# EAGLE board LEDSyncDRVG2 (EAGLE 9.6.2), part 1 of 3
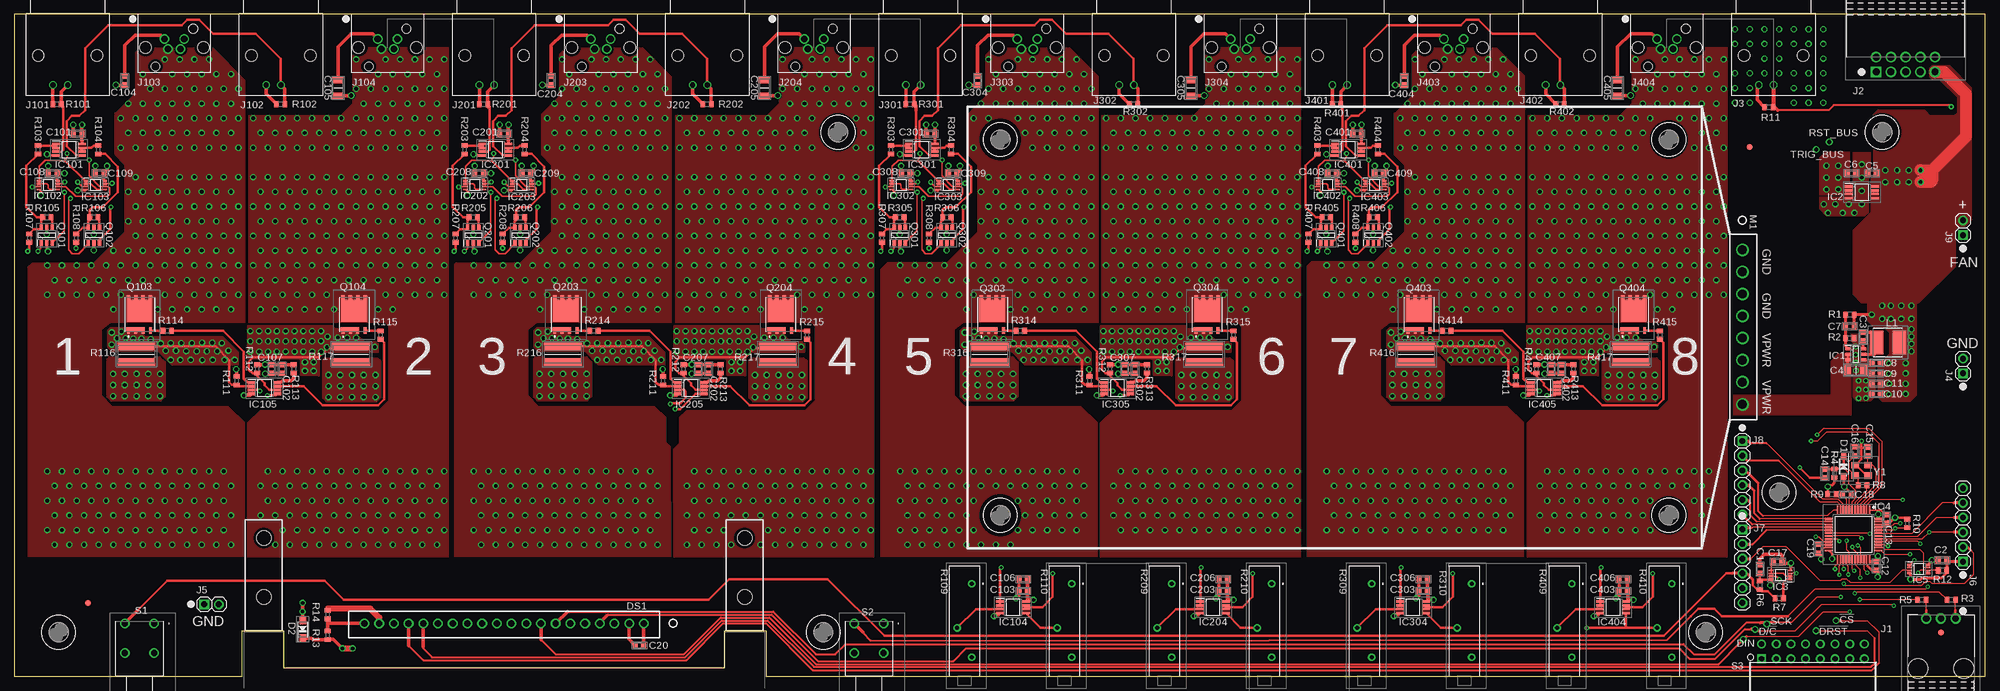
[diagram p5: board, top side]
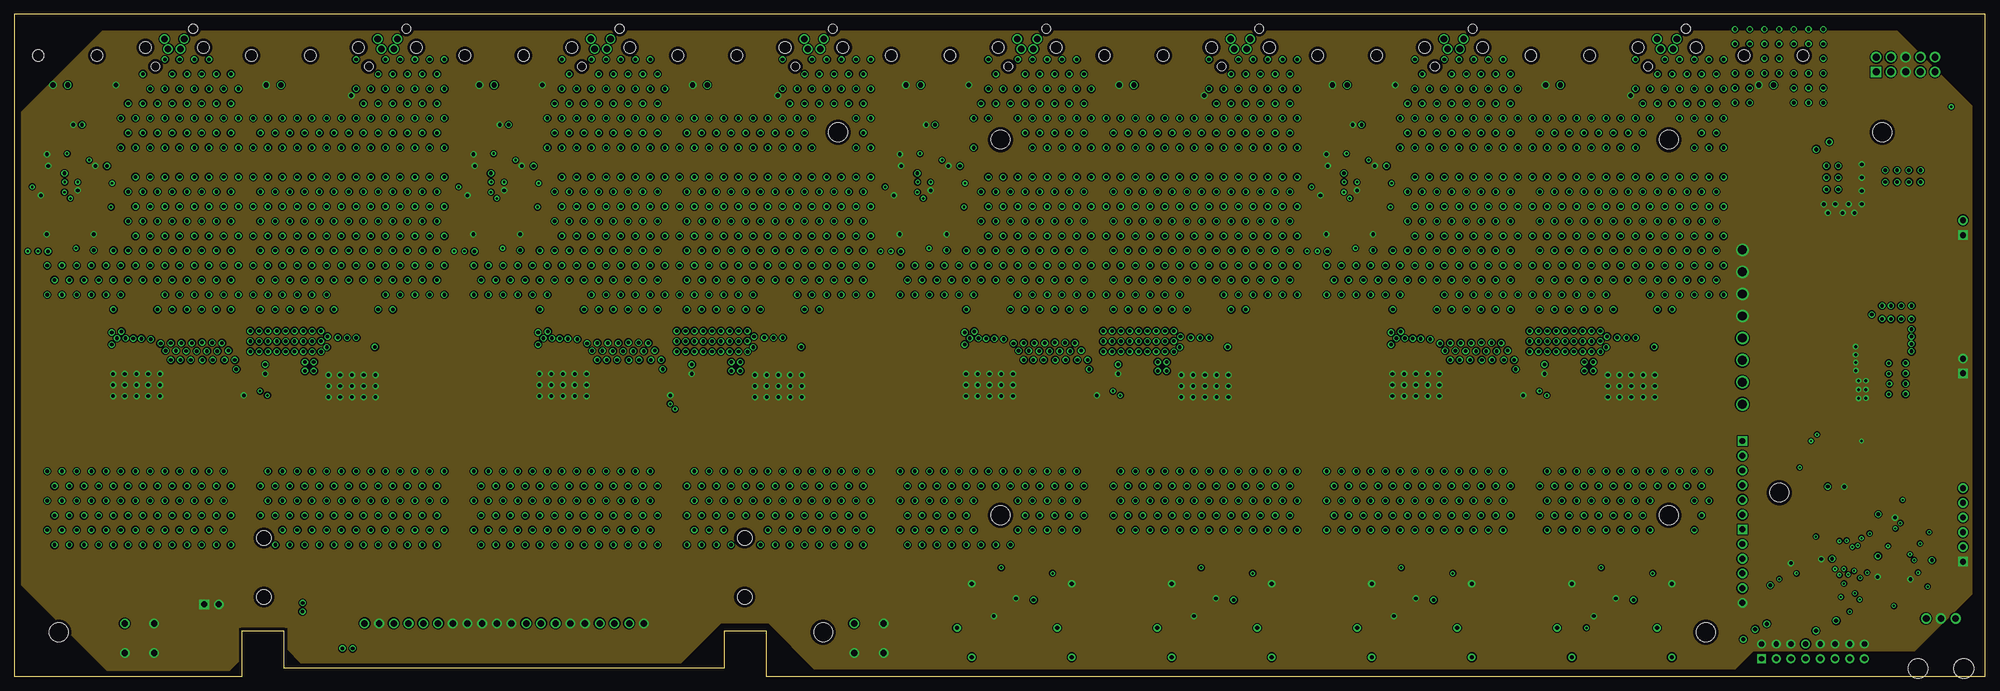
[diagram p6: board, inner layer Route2]
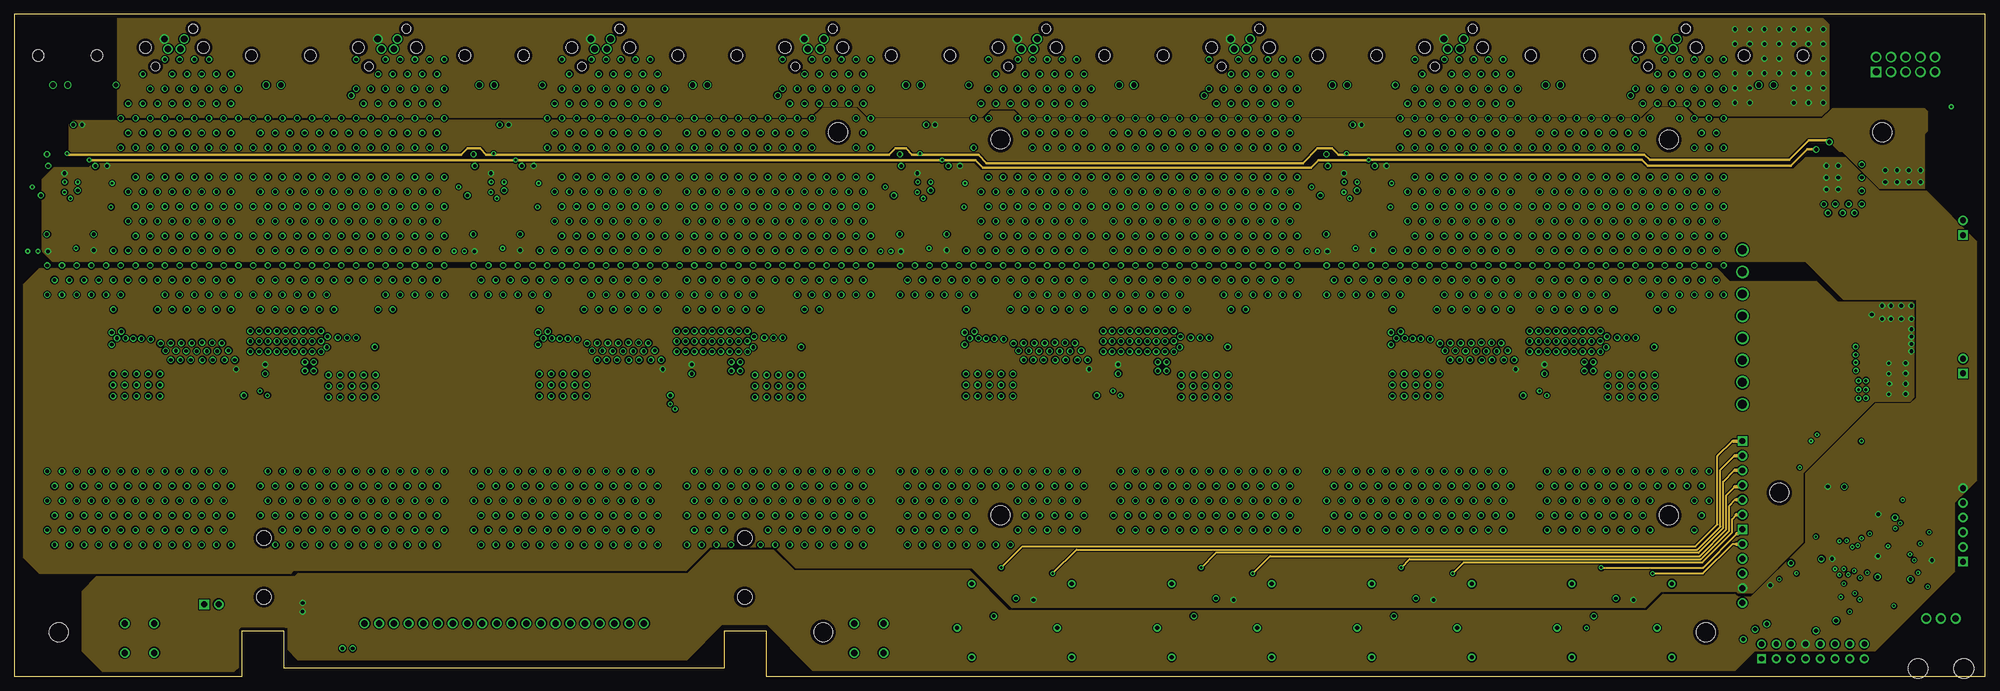
[diagram p7: board, inner layer Route15]
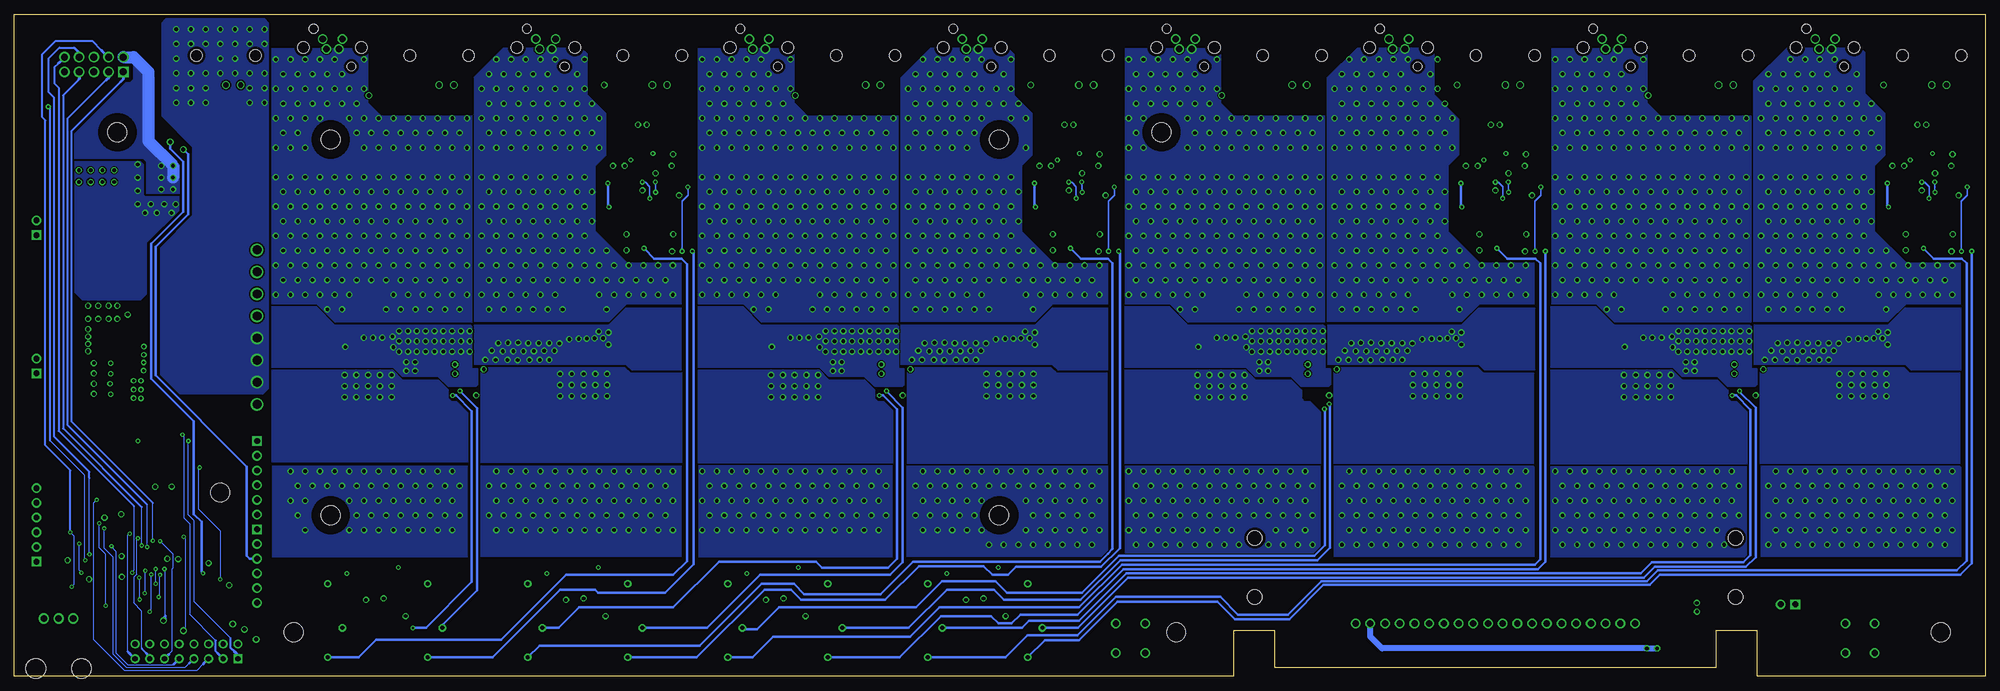
[diagram p8: board, bottom side, seen from below]

Size 340.36 x 114.3 mm. Coordinates in mm from the lower left corner, seen from the top.
Outline: 0,0 39.37,0 39.37,7.87 46.48,7.87 46.48,1.52 122.68,1.52 122.68,7.87 129.79,7.87 129.79,0 340.36,0 340.36,114.3 0,114.3 0,0
Copper layers (1+2*15+16): Top 0.035mm / dielectric 0.6mm / Route2 0.035mm / dielectric 0.25mm / Route15 0.035mm / dielectric 0.6mm / Bottom 0.035mm
Design rules "default *": minimum track width 8mil, minimum drill 0.3mm, track to track 8mil, track to pad 8mil, pad to pad 7.5mil, via to via 8mil, smd to smd 6mil, copper to edge 20mil, drill to drill 20mil, minimum pad ring 6mil, minimum via ring 8mil, stop-mask expansion 4mil, vias tented up to drill 26mil, thermal gap 10mil

## Footprints (pad centres in the part's own frame; a part is rotated, then mirrored left to right if it is on the bottom)
MLCC_0603 = smd 0.813 x 1.041: 1 -0.72,0; 2 0.72,0
MLCC_1206 = smd 1.07 x 1.78: 1 -1.36,0; 2 1.36,0
SOD3716X135N_DIODE = smd 1.15 x 0.8: 1 -1.75,0; 2 1.75,0
SOD-123FL = smd 1.24 x 1.12: 1 -1.5,0; 2 1.5,0
DISPLAY20P = drill 1.11 pad 1.665: 1 -24.13,0; 2 -21.59,0; 3 -19.05,0; 4 -16.51,0; 5 -13.97,0; 6 -11.43,0; 7 -8.89,0; 8 -6.35,0; 9 -3.81,0; 10 -1.27,0; 11 1.27,0; 12 3.81,0; 13 6.35,0; 14 8.89,0; 15 11.43,0; 16 13.97,0; 17 16.51,0; 18 19.05,0; 19 21.59,0; 20 24.13,0 | hole 2.54: -41.529,-14.732; -41.529,-4.572; 41.529,-14.732; 41.529,-4.572
4-40_130HOLE_260CLEAR = hole 3.302: 0,0
SOT95P280X100-6N = smd 1.05 x 0.55: 1 -1.3,0.95; 2 -1.3,0; 3 -1.3,-0.95; 4 1.3,-0.95; 5 1.3,0; 6 1.3,0.95
VSSOP8-DGK-065P = smd 1.4 x 0.45: 1 -2.2,0.975; 2 -2.2,0.325; 3 -2.2,-0.325; 4 -2.2,-0.975; 5 2.2,-0.975; 6 2.2,-0.325; 7 2.2,0.325; 8 2.2,0.975
SOP50P310X90-8N = smd 0.85 x 0.3: 1 -1.575,0.75; 2 -1.575,0.25; 3 -1.575,-0.25; 4 -1.575,-0.75; 5 1.575,-0.75; 6 1.575,-0.25; 7 1.575,0.25; 8 1.575,0.75
QFP50P900X900X160-48N = smd 1.475 x 0.3: 1 -4.238,2.75; 2 -4.238,2.25; 3 -4.238,1.75; 4 -4.238,1.25; 5 -4.238,0.75; 6 -4.238,0.25; 7 -4.238,-0.25; 8 -4.238,-0.75; 9 -4.238,-1.25; 10 -4.238,-1.75; 11 -4.238,-2.25; 12 -4.238,-2.75; 25 4.238,-2.75; 26 4.238,-2.25; 27 4.238,-1.75; 28 4.238,-1.25; 29 4.238,-0.75; 30 4.238,-0.25; 31 4.238,0.25; 32 4.238,0.75; 33 4.238,1.25; 34 4.238,1.75; 35 4.238,2.25; 36 4.238,2.75 | smd 0.3 x 1.475: 13 -2.75,-4.238; 14 -2.25,-4.238; 15 -1.75,-4.238; 16 -1.25,-4.238; 17 -0.75,-4.238; 18 -0.25,-4.238; 19 0.25,-4.238; 20 0.75,-4.238; 21 1.25,-4.238; 22 1.75,-4.238; 23 2.25,-4.238; 24 2.75,-4.238; 37 2.75,4.238; 38 2.25,4.238; 39 1.75,4.238; 40 1.25,4.238; 41 0.75,4.238; 42 0.25,4.238; 43 -0.25,4.238; 44 -0.75,4.238; 45 -1.25,4.238; 46 -1.75,4.238; 47 -2.25,4.238; 48 -2.75,4.238
HDR_1X3RAS = drill 1.17 pad 1.755: 1 0,0; 2 -2.54,0; 3 -5.08,0 | hole 3.45: -6.48,-8.64; 1.4,-8.64
HDR_2X5M_RAS = drill 1.2 pad 1.8 square: 1 0,0 | drill 1.2 pad 1.8: 2 0,2.54; 3 2.54,0; 4 2.54,2.54; 5 5.08,0; 6 5.08,2.54; 7 7.62,0; 8 7.62,2.54; 9 10.16,0; 10 10.16,2.54
BNC_AMP_227161 = drill 0.9 pad 1.27: 1 0,-5.08; 2 -2.54,-5.08 | hole 2: -5.08,0; 5.08,0
HDR_1X2 = drill 1.016 pad 1.651 square: 1 -2.54,0 | drill 1.016 pad 1.651: 2 0,0
HDR_1X06 = drill 1.016 pad 1.651 square: 1 -6.35,0 | drill 1.016 pad 1.651: 2 -3.81,0; 3 -1.27,0; 4 1.27,0; 5 3.81,0; 6 6.35,0
CIR_PHX4P_RA = drill 1.143 pad 1.626: 1 1.702,-1.499; 2 1.067,0.254; 3 -1.067,0.254; 4 -1.702,-1.499 | hole 1.524: -3.251,-3.251; 3.251,3.251 | hole 2.032: 5.004,0; -5.004,0
IND_5X5MM-5045 = smd 2.3 x 4: 1 -2,0; 2 2,0
PS_5X3_MOLEX8P = drill 1.524 pad 2.159: 1 12.7,-19.05; 2 12.7,-22.86; 3 12.7,-26.67; 4 12.7,-30.48; 5 12.7,-34.29; 6 12.7,-38.1; 7 12.7,-41.91; 8 12.7,-45.72 | hole 3.302: 0,0; -115.468,0; -115.468,-64.897; 0,-64.897
TDSON-8 = smd 0.5 x 0.5: 1 -1.905,-3.075; 2 -0.635,-3.075; 3 0.635,-3.075 | smd 0.5 x 1.1: 4 1.905,-2.775 | smd 0.6 x 0.8: 5 1.905,2.925; 6 0.635,2.925; 7 -0.635,2.925; 8 -1.905,2.925 | smd 4.41 x 3.75: 9 0,0.65 | smd 3.2 x 0.6: 10 -0.715,-2.525
R0603 = smd 0.813 x 1.041: 1 -0.72,0; 2 0.72,0
MTBOURNS_RA_LONG = drill 0.74 pad 1.269: 1 0,0; 2 7.62,-2.54; 3 12.7,0
R1225 = smd 1.35 x 6.5: 1 -1.35,0; 2 1.35,0
SITCH_PB_RA_800SP9B6M6RE = drill 1.09 pad 1.635: 1 0,0; 3 5.08,0; MH1 0,5.08; MH2 5.08,5.08
SWITCHX8_DIP_RA_0.1IN = drill 0.914 pad 1.524 square: 1 0,0 | drill 0.914 pad 1.524: 2 0,2.54; 3 2.54,0; 4 2.54,2.54; 5 5.08,0; 6 5.08,2.54; 7 7.62,0; 8 7.62,2.54; 9 10.16,0; 10 10.16,2.54; 11 12.7,0; 12 12.7,2.54; 13 15.24,0; 14 15.24,2.54; 15 17.78,0; 16 17.78,2.54
FIDUCIAL_1MM = smd 1 x 1: 1 0,0
XTAL4P_3.2X2.5MM = smd 1.3 x 1.1: 1 -1.15,-0.9; 2 1.15,-0.9; 3 1.15,0.9; 4 -1.15,0.9

## Placement (x,y rotation side)
C1  0.10uF  [MLCC_0603]  301.5,18.54 270 top
C2  0.10uF  [MLCC_0603]  332.99,20.07 180 top
C3  0.10uF  [MLCC_0603]  319.28,58.67 90 top
C4  10uF  [MLCC_1206]  318.01,52.83 0 top
C5  1uF  [MLCC_0603]  320.85,86.89 180 top
C6  1uF  [MLCC_0603]  317.3,86.89 0 top
C7  47pF  [MLCC_0603]  316.99,60.45 0 top
C8  10uF  [MLCC_0603]  321.56,54.1 0 top
C9  10uF  [MLCC_0603]  321.56,52.32 0 top
C10  10uF  [MLCC_0603]  321.56,48.77 0 top
C11  10uF  [MLCC_0603]  321.56,50.55 0 top
C12  0.10uF  [MLCC_0603]  321.56,19.05 90 top
C13  0.10uF  [MLCC_0603]  323.34,27.18 90 top
C14  0.10uF  [MLCC_0603]  312.67,35.05 270 top
C15  10pF  [MLCC_0603]  320.14,38.86 270 top
C16  10pF  [MLCC_0603]  317.88,38.89 270 top
C17  1uF  [MLCC_0603]  304.55,19.81 0 top
C18  0.10uF  [MLCC_0603]  316.48,31.39 180 top
C19  10uF  [MLCC_0603]  311.56,22.05 90 top
C20  0.10uF  [MLCC_0603]  107.95,5.33 0 top
C101  0.10uF  [MLCC_0603]  10.92,93.73 0 top
C102  0.10uF  [MLCC_0603]  46.23,53.09 90 top
C103  0.10uF  [MLCC_0603]  174.24,14.73 0 top
C104  0.10uF  [MLCC_0603]  19.05,102.87 90 top
C105  10uF  [MLCC_1206]  55.88,101.6 270 top
C106  10uF  [MLCC_0603]  174.24,16.76 0 top
C107  10uF  [MLCC_0603]  44.45,53.09 90 top
C108  0.10uF  [MLCC_0603]  6.6,86.87 0 top
C109  0.10uF  [MLCC_0603]  14.73,86.87 0 top
C201  0.10uF  [MLCC_0603]  84.58,93.73 0 top
C202  0.10uF  [MLCC_0603]  119.89,53.09 90 top
C203  0.10uF  [MLCC_0603]  208.79,14.73 0 top
C204  0.10uF  [MLCC_0603]  92.71,102.87 90 top
C205  10uF  [MLCC_1206]  129.54,101.6 270 top
C206  10uF  [MLCC_0603]  208.79,16.76 0 top
C207  10uF  [MLCC_0603]  118.11,53.09 90 top
C208  0.10uF  [MLCC_0603]  80.26,86.87 0 top
C209  0.10uF  [MLCC_0603]  88.39,86.87 0 top
C301  0.10uF  [MLCC_0603]  158.24,93.73 0 top
C302  0.10uF  [MLCC_0603]  193.55,53.09 90 top
C303  0.10uF  [MLCC_0603]  243.33,14.73 0 top
C304  0.10uF  [MLCC_0603]  166.37,102.87 90 top
C305  10uF  [MLCC_1206]  203.2,101.6 270 top
C306  10uF  [MLCC_0603]  243.33,16.76 0 top
C307  10uF  [MLCC_0603]  191.77,53.09 90 top
C308  0.10uF  [MLCC_0603]  153.92,86.87 0 top
C309  0.10uF  [MLCC_0603]  162.05,86.87 0 top
C401  0.10uF  [MLCC_0603]  231.9,93.73 0 top
C402  0.10uF  [MLCC_0603]  267.21,53.09 90 top
C403  0.10uF  [MLCC_0603]  277.88,14.73 0 top
C404  0.10uF  [MLCC_0603]  240.03,102.87 90 top
C405  10uF  [MLCC_1206]  276.86,101.6 270 top
C406  10uF  [MLCC_0603]  277.88,16.76 0 top
C407  10uF  [MLCC_0603]  265.43,53.09 90 top
C408  0.10uF  [MLCC_0603]  227.58,86.87 0 top
C409  0.10uF  [MLCC_0603]  235.71,86.87 0 top
D1  3.6V  [SOD3716X135N_DIODE]  315.98,36.25 270 top
D2  NHP140  [SOD-123FL]  49.78,8.13 90 top
DS1  OLED Display Yellow 256X64  [DISPLAY20P]  84.58,9.14 180 top
H1  M-HOLE130MIL  [4-40_130HOLE_260CLEAR]  292.1,7.62 0 top
H2  M-HOLE130MIL  [4-40_130HOLE_260CLEAR]  304.8,31.75 0 top
H3  M-HOLE130MIL  [4-40_130HOLE_260CLEAR]  142.24,93.98 0 top
H4  M-HOLE130MIL  [4-40_130HOLE_260CLEAR]  322.58,93.98 0 top
H5  M-HOLE130MIL  [4-40_130HOLE_260CLEAR]  139.7,7.62 0 top
H6  M-HOLE130MIL  [4-40_130HOLE_260CLEAR]  7.62,7.62 0 top
IC1  AP63200  [SOT95P280X100-6N]  318.01,55.63 0 top
IC2  TLV76733  [VSSOP8-DGK-065P]  319.07,83.59 0 top
IC3  TC7WZ08  [SOP50P310X90-8N]  305.05,17.53 180 top
IC4  STM32F410  [QFP50P900X900X160-48N]  317.65,24.49 270 top
IC5  TC7WZ08  [SOP50P310X90-8N]  328.93,18.54 0 top
IC101  TLV2197  [VSSOP8-DGK-065P]  9.4,90.93 0 top
IC102  TC7WZ08  [SOP50P310X90-8N]  5.84,84.84 0 top
IC103  TC7WZ08  [SOP50P310X90-8N]  13.97,84.84 0 top
IC104  TLV2197  [VSSOP8-DGK-065P]  172.47,11.94 0 top
IC105  TLV2197  [VSSOP8-DGK-065P]  43.18,49.78 0 top
IC201  TLV2197  [VSSOP8-DGK-065P]  83.06,90.93 0 top
IC202  TC7WZ08  [SOP50P310X90-8N]  79.5,84.84 0 top
IC203  TC7WZ08  [SOP50P310X90-8N]  87.63,84.84 0 top
IC204  TLV2197  [VSSOP8-DGK-065P]  207.01,11.94 0 top
IC205  TLV2197  [VSSOP8-DGK-065P]  116.84,49.78 0 top
IC301  TLV2197  [VSSOP8-DGK-065P]  156.72,90.93 0 top
IC302  TC7WZ08  [SOP50P310X90-8N]  153.16,84.84 0 top
IC303  TC7WZ08  [SOP50P310X90-8N]  161.29,84.84 0 top
IC304  TLV2197  [VSSOP8-DGK-065P]  241.55,11.94 0 top
IC305  TLV2197  [VSSOP8-DGK-065P]  190.5,49.78 0 top
IC401  TLV2197  [VSSOP8-DGK-065P]  230.38,90.93 0 top
IC402  TC7WZ08  [SOP50P310X90-8N]  226.82,84.84 0 top
IC403  TC7WZ08  [SOP50P310X90-8N]  234.95,84.84 0 top
IC404  TLV2197  [VSSOP8-DGK-065P]  276.1,11.94 0 top
IC405  TLV2197  [VSSOP8-DGK-065P]  264.16,49.78 0 top
J1  HDR 1X3 RA-M  [HDR_1X3RAS]  335.28,10.01 0 top
J2  HDR 2X5 RA-M  [HDR_2X5M_RAS]  321.56,104.39 0 top
J3  RA BNC 50 Ohm  [BNC_AMP_227161]  303.83,107.19 0 top
J4  HDR 1x2 ST-M  [HDR_1X2]  336.55,54.86 90 top
J5  HDR 1x2 ST-M  [HDR_1X2]  35.31,12.45 0 top
J6  HDR 1x6 ST-M  [HDR_1X06]  336.55,26.16 90 top
J7  HDR 1x6 ST-M  [HDR_1X06]  298.45,19.05 270 top
J8  HDR 1x6 ST-M  [HDR_1X06]  298.45,34.29 270 top
J9  HDR 1x2 ST-M  [HDR_1X2]  336.55,78.74 90 top
J101  RA BNC 50 Ohm  [BNC_AMP_227161]  9.19,107.19 0 top
J102  RA BNC 50 Ohm  [BNC_AMP_227161]  46.02,107.19 0 top
J103  4P Thor LED RA  [CIR_PHX4P_RA]  27.61,108.58 180 top
J104  4P Thor LED RA  [CIR_PHX4P_RA]  64.44,108.58 180 top
J201  RA BNC 50 Ohm  [BNC_AMP_227161]  82.85,107.19 0 top
J202  RA BNC 50 Ohm  [BNC_AMP_227161]  119.68,107.19 0 top
J203  4P Thor LED RA  [CIR_PHX4P_RA]  101.27,108.58 180 top
J204  4P Thor LED RA  [CIR_PHX4P_RA]  138.1,108.58 180 top
J301  RA BNC 50 Ohm  [BNC_AMP_227161]  156.51,107.19 0 top
J302  RA BNC 50 Ohm  [BNC_AMP_227161]  193.34,107.19 0 top
J303  4P Thor LED RA  [CIR_PHX4P_RA]  174.93,108.58 180 top
J304  4P Thor LED RA  [CIR_PHX4P_RA]  211.76,108.58 180 top
J401  RA BNC 50 Ohm  [BNC_AMP_227161]  230.17,107.19 0 top
J402  RA BNC 50 Ohm  [BNC_AMP_227161]  267,107.19 0 top
J403  4P Thor LED RA  [CIR_PHX4P_RA]  248.59,108.58 180 top
J404  4P Thor LED RA  [CIR_PHX4P_RA]  285.42,108.58 180 top
L1  10uH  [IND_5X5MM-5045]  323.6,57.66 0 top
M1  7.5V 13.4A PS  [PS_5X3_MOLEX8P]  285.75,92.71 0 top
Q101  DMG6601  [SOT95P280X100-6N]  5.59,76.2 90 top
Q102  DMG6601  [SOT95P280X100-6N]  13.72,76.2 90 top
Q103  BSC12DN20N  [TDSON-8]  21.59,62.48 0 top
Q104  BSC12DN20N  [TDSON-8]  58.67,62.48 0 top
Q201  DMG6601  [SOT95P280X100-6N]  79.25,76.2 90 top
Q202  DMG6601  [SOT95P280X100-6N]  87.38,76.2 90 top
Q203  BSC12DN20N  [TDSON-8]  95.25,62.48 0 top
Q204  BSC12DN20N  [TDSON-8]  132.33,62.48 0 top
Q301  DMG6601  [SOT95P280X100-6N]  152.91,76.2 90 top
Q302  DMG6601  [SOT95P280X100-6N]  161.04,76.2 90 top
Q303  BSC12DN20N  [TDSON-8]  168.91,62.48 0 top
Q304  BSC12DN20N  [TDSON-8]  205.99,62.48 0 top
Q401  DMG6601  [SOT95P280X100-6N]  226.57,76.2 90 top
Q402  DMG6601  [SOT95P280X100-6N]  234.7,76.2 90 top
Q403  BSC12DN20N  [TDSON-8]  242.57,62.48 0 top
Q404  BSC12DN20N  [TDSON-8]  279.65,62.48 0 top
R1  56 kΩ  [R0603]  316.99,62.48 0 top
R2  10 kΩ  [R0603]  316.99,58.42 0 top
R3  100 Ω  [R0603]  334.52,13.21 0 top
R4  10 kΩ  [R0603]  314.35,35.08 270 top
R5  100 Ω  [R0603]  329.44,13.21 0 top
R6  10 kΩ  [R0603]  301.5,15.75 90 top
R7  100 Ω  [R0603]  304.8,13.46 0 top
R8  100 Ω  [R0603]  319.2,33.05 0 top
R9  0 Ω  [R0603]  313.89,31.45 180 top
R10  10 kΩ  [R0603]  326.9,26.42 270 top
R11  10 kΩ  [R0603]  303.02,98.3 0 top
R12  10 kΩ  [R0603]  332.99,18.29 0 top
R13  0 Ω  [R0603]  54.1,7.11 270 top
R14  NP  [R0603]  54.1,10.67 270 top
R101  10 kΩ  [R0603]  7.37,98.81 0 top
R102  10 kΩ  [R0603]  45.97,98.81 0 top
R103  4.3 kΩ  [R0603]  4.06,90.93 90 top
R104  4.3 kΩ  [R0603]  14.48,90.93 90 top
R105  33 Ω  [R0603]  5.59,79.25 180 top
R106  33 Ω  [R0603]  13.72,79.25 180 top
R107  3.3 kΩ  [R0603]  2.54,75.69 270 top
R108  3.3 kΩ  [R0603]  10.67,75.69 270 top
R109  5K  [MTBOURNS_RA_LONG]  165.35,16 270 top
R110  5K  [MTBOURNS_RA_LONG]  182.63,16 270 top
R111  10 kΩ  [R0603]  38.35,51.05 90 top
R112  10 kΩ  [R0603]  41.91,53.09 90 top
R113  0 Ω  [R0603]  48.26,53.09 90 top
R114  33 Ω  [R0603]  26.42,59.69 180 top
R115  33 Ω  [R0603]  63.25,58.93 90 top
R116  1 Ohm  [R1225]  21.08,55.63 90 top
R117  1 Ohm  [R1225]  58.17,55.63 90 top
R201  10 kΩ  [R0603]  81.03,98.81 0 top
R202  10 kΩ  [R0603]  119.63,98.81 0 top
R203  4.3 kΩ  [R0603]  77.72,90.93 90 top
R204  4.3 kΩ  [R0603]  88.14,90.93 90 top
R205  33 Ω  [R0603]  79.25,79.25 180 top
R206  33 Ω  [R0603]  87.38,79.25 180 top
R207  3.3 kΩ  [R0603]  76.2,75.69 270 top
R208  3.3 kΩ  [R0603]  84.33,75.69 270 top
R209  5K  [MTBOURNS_RA_LONG]  199.9,16 270 top
R210  5K  [MTBOURNS_RA_LONG]  217.17,16 270 top
R211  10 kΩ  [R0603]  112.01,51.05 90 top
R212  10 kΩ  [R0603]  115.57,53.09 90 top
R213  0 Ω  [R0603]  121.92,53.09 90 top
R214  33 Ω  [R0603]  100.08,59.69 180 top
R215  33 Ω  [R0603]  136.91,58.93 90 top
R216  1 Ohm  [R1225]  94.74,55.63 90 top
R217  1 Ohm  [R1225]  131.83,55.63 90 top
R301  10 kΩ  [R0603]  154.69,98.81 0 top
R302  10 kΩ  [R0603]  193.29,98.81 0 top
R303  4.3 kΩ  [R0603]  151.38,90.93 90 top
R304  4.3 kΩ  [R0603]  161.8,90.93 90 top
R305  33 Ω  [R0603]  152.91,79.25 180 top
R306  33 Ω  [R0603]  161.04,79.25 180 top
R307  3.3 kΩ  [R0603]  149.86,75.69 270 top
R308  3.3 kΩ  [R0603]  157.99,75.69 270 top
R309  5K  [MTBOURNS_RA_LONG]  234.44,16 270 top
R310  5K  [MTBOURNS_RA_LONG]  251.71,16 270 top
R311  10 kΩ  [R0603]  185.67,51.05 90 top
R312  10 kΩ  [R0603]  189.23,53.09 90 top
R313  0 Ω  [R0603]  195.58,53.09 90 top
R314  33 Ω  [R0603]  173.74,59.69 180 top
R315  33 Ω  [R0603]  210.57,58.93 90 top
R316  1 Ohm  [R1225]  168.4,55.63 90 top
R317  1 Ohm  [R1225]  205.49,55.63 90 top
R401  10 kΩ  [R0603]  228.35,98.81 0 top
R402  10 kΩ  [R0603]  266.95,98.81 0 top
R403  4.3 kΩ  [R0603]  225.04,90.93 90 top
R404  4.3 kΩ  [R0603]  235.46,90.93 90 top
R405  33 Ω  [R0603]  226.57,79.25 180 top
R406  33 Ω  [R0603]  234.7,79.25 180 top
R407  3.3 kΩ  [R0603]  223.52,75.69 270 top
R408  3.3 kΩ  [R0603]  231.65,75.69 270 top
R409  5K  [MTBOURNS_RA_LONG]  268.99,16 270 top
R410  5K  [MTBOURNS_RA_LONG]  286.26,16 270 top
R411  10 kΩ  [R0603]  259.33,51.05 90 top
R412  10 kΩ  [R0603]  262.89,53.09 90 top
R413  0 Ω  [R0603]  269.24,53.09 90 top
R414  33 Ω  [R0603]  247.4,59.69 180 top
R415  33 Ω  [R0603]  284.23,58.93 90 top
R416  1 Ohm  [R1225]  242.06,55.63 90 top
R417  1 Ohm  [R1225]  279.15,55.63 90 top
S1  SPST RA  [SITCH_PB_RA_800SP9B6M6RE]  24.13,9.14 180 top
S2  SPST RA  [SITCH_PB_RA_800SP9B6M6RE]  150.11,9.14 180 top
S3  DIP8-RA  [SWITCHX8_DIP_RA_0.1IN]  301.75,3.05 0 top
U$1  FIDUCIAL  [FIDUCIAL_1MM]  12.7,12.7 0 top
U$2  FIDUCIAL  [FIDUCIAL_1MM]  299.72,91.44 0 top
U$3  FIDUCIAL  [FIDUCIAL_1MM]  332.74,7.62 0 top
Y1  24.0MHz  [XTAL4P_3.2X2.5MM]  319.02,35.56 0 top

## Tracks (layer width: path | path; a pad name or v marks a point on that pad's centre or on a via)
!CS  (via drill 0.3, 0.74)
  Top 0.203: 322.07,2.33 322.07,7.62 320.04,9.65 315.47,9.65 | v314.45,18.54 314.45,19.02 314.9,19.47 IC4.25
  Top 0.305: 68.07,5.33 70.61,2.79 116.08,2.79 122.43,9.14 129.79,9.14 137.85,1.09 320.83,1.09 322.07,2.33
  Top 0.508: v314.63,9.63 314.65,9.65 315.47,9.65
  Top 0.61: DS1.17 68.07,5.33
  Bottom 0.203: v314.45,18.54 314.3,18.39 314.3,10.41
  Bottom 0.508: v314.63,9.63 314.3,9.96 314.3,10.41
!D_RES  (via drill 0.3, 0.74)
  Top 0.203: 311.91,7.87 320.04,7.87 321.31,6.6 | v311.15,24.13 311.63,24.13 312.52,23.24 IC4.21
  Top 0.305: 70.61,5.08 70.61,4.83 72.14,3.3 115.82,3.3 122.17,9.65 130.08,9.65 138.1,1.63 320.65,1.63 321.31,2.29 321.31,6.6
  Top 0.508: v311.15,7.87 311.91,7.87
  Top 0.61: DS1.16 70.61,5.08
  Bottom 0.203: v311.15,24.13 310.9,23.88 310.9,8.13 v311.15,7.87
+3.3V  (via drill 0.64)
  Top 0.203: IC402.8 228.3,85.68 228.3,85.76 | IC102.8 7.32,85.68 | IC4.36 320.4,20.03 320.66,19.77 | IC202.8 80.98,85.68
  Top 0.279: IC103.8 15.54,85.75 | 7.32,85.68 7.32,85.76 | IC203.8 89.2,85.75 | 80.98,85.68 80.98,85.76 | IC303.8 162.87,85.75 | IC302.8 154.64,85.68 154.64,85.76 | IC403.8 236.53,85.75 | 303.48,16.72 IC3.8 303.53,16.73 303.53,16.26 | 321.92,28.73 322.33,28.73 323.15,27.9 C13.2 322.68,27.24 IC4.48 321.92,27.27 321.92,27.43 | 321.92,28.73 IC4.1 | 321.92,28.73 321.92,28.45 | IC5.8 330.74,19.53 | IC4.24 313.56,21.59
  Top 0.406: Q101.2 5.59,73.58 5.66,73.51 5.68,73.51 v5.79,73.4 | v13.69,73.58 13.69,74.88 Q102.2 | Q201.2 79.25,73.58 79.32,73.51 79.34,73.51 v79.45,73.4 | v87.35,73.58 87.35,74.88 Q202.2 | Q301.2 152.91,73.58 152.98,73.51 153,73.51 v153.11,73.4 | v161.01,73.58 161.01,74.88 Q302.2 | Q401.2 226.57,73.58 226.64,73.51 226.66,73.51 v226.77,73.4 | v234.67,73.58 234.67,74.88 Q402.2 | 303.48,16.72 301.75,16.72 R6.2 C1.2 | R9.2 313.17,32.73 v313.21,32.77 313.46,33.02 313.94,33.02 314.35,33.43 R4.2 | 313.56,21.59 313.94,21.21 v313.94,20.32
  Top 0.508: C109.2 15.45,85.84 15.54,85.75 | C108.2 7.32,85.76 | C209.2 89.11,85.84 89.2,85.75 | C208.2 80.98,85.76 | C309.2 162.77,85.84 162.87,85.75 | C308.2 154.64,85.76 | C409.2 236.43,85.84 236.53,85.75 | 228.3,85.76 C408.2 | C12.2 321.69,19.9 321.69,20.6 v321.86,20.76 | C2.2 331.2,20.07 v331.18,20.05 331.18,19.96 330.74,19.53
  Top 0.61: C108.2 v8.64,86.87 | C109.2 16,87.42 v16,88.14 | C208.2 v82.3,86.87 | C209.2 89.66,87.42 v89.66,88.14 | C308.2 v155.96,86.87 | C309.2 163.32,87.42 v163.32,88.14 | C408.2 v229.62,86.87 | C409.2 236.98,87.42 v236.98,88.14 | D2.2 v49.76,11.2 49.77,11.21 v49.78,12.7 | 303.53,16.26 303.53,15.98 303.3,15.75 v303.28,15.75 | 321.92,28.45 v321.92,27.99 321.92,27.43 | C12.2 320.66,19.77
  Bottom 2.032: J2.2 319.79,106.93 317.25,104.39 317.25,92.43 v312.98,88.16 v312.98,86.13
  other vias: 315.01,88.16 315.01,86.13 315.01,84.1 312.98,84.1
  pour Top (no thermals): 311.71,83.13 315.87,83.13 315.87,83.57 316.08,83.77 317.53,83.77 317.53,84.73 317.04,85.22 317.04,87.33 316.99,87.33 316.99,90.47 312.75,90.47 311.71,89.43
  pour Bottom: 311.91,88.14 311.91,83.31 317.5,83.31 317.5,88.9 318.01,89.41 329.95,89.41 329.95,93.73 321.31,102.36 321.06,102.62 320.29,102.62 319.79,103.12 319.79,105.66 318.52,105.66 316.23,103.38 316.23,100.33 316.23,92.71 311.91,88.39
  pour Route15 (no thermals): 6.86,87.88 12.95,87.88 13.72,88.65 165.61,88.65 166.88,87.38 224.03,87.38 225.3,88.65 280.92,88.65 281.94,87.63 307.34,87.63 309.37,89.66 316.23,89.66 322.07,83.82 330.2,83.82 338.84,75.18 338.84,33.78 335.03,29.97 335.03,18.03 321.31,4.32 300.48,4.32 297.18,1.02 137.92,1.02 130.05,8.89 122.17,8.89 116.08,2.79 49.02,2.79 47.24,4.57 47.24,16 49.02,17.78 116.33,17.78 120.4,21.84 131.06,21.84 134.62,18.29 164.85,18.29 171.7,11.43 281.94,11.43 284.73,14.22 297.18,14.22 297.69,13.72 299.97,13.72 309.37,23.11 309.37,35.05 321.46,47.14 327.56,47.14 328.55,48.13 328.55,65.02 315.98,65.02 309.37,71.63 6.6,71.63 4.83,73.41 4.83,85.85
  pour Route15 (no thermals): 50.8,8.38 39.12,8.38 38.61,7.87 38.61,1.52 37.85,0.76 15.24,0.76 11.68,4.32 11.68,14.73 14.22,17.27 50.8,17.27
+5V  (via drill 0.51, 0.64)
  Top 0.406: 11.68,92.46 11.68,91.99 IC101.8 | IC104.8 175.01,13.25 | 175.01,14.69 C103.2 | 85.34,92.46 85.34,91.99 IC201.8 | IC204.8 209.55,13.25 | 209.55,14.69 C203.2 | 159,92.46 159,91.99 IC301.8 | IC304.8 244.09,13.25 | 244.09,14.69 C303.2 | 232.66,92.46 232.66,91.99 IC401.8 | IC404.8 278.64,13.25 | 278.64,14.69 C403.2
  Top 0.508: v320.8,62.48 R1.2 | R1.2 317.71,61.21 | R1.2 C7.2
  Top 0.61: 11.68,92.46 11.64,92.5 C101.2 11.64,95.21 v11.68,95.25 | R112.2 41.96,53.86 v43.31,53.86 44.4,53.86 C107.2 C102.2 R113.2 | R111.2 38.35,53.09 v38.31,53.04 | 175.01,14.69 175.01,13.25 175.98,13.25 v176.02,13.21 | C103.2 C106.2 | 85.34,92.46 85.3,92.5 C201.2 85.3,95.21 v85.34,95.25 | R212.2 115.62,53.86 v116.97,53.86 118.06,53.86 C207.2 C202.2 R213.2 | R211.2 112.01,53.09 v111.97,53.04 | 209.55,14.69 209.55,13.25 210.52,13.25 v210.57,13.21 | C203.2 C206.2 | 159,92.46 158.96,92.5 C301.2 158.96,95.21 v159,95.25 | R312.2 189.28,53.86 v190.63,53.86 191.72,53.86 C307.2 C302.2 R313.2 | R311.2 185.67,53.09 v185.63,53.04 | 244.09,14.69 244.09,13.25 245.06,13.25 v245.11,13.21 | C303.2 C306.2 | 232.66,92.46 232.62,92.5 C401.2 232.62,95.21 v232.66,95.25 | R412.2 262.94,53.86 v264.29,53.86 265.38,53.86 C407.2 C402.2 R413.2 | R411.2 259.33,53.09 v259.29,53.04 | 278.64,14.69 278.64,13.25 279.61,13.25 v279.65,13.21 | C403.2 C406.2
  Top 2.032: J2.9 333.25,104.39 337.06,100.58 337.06,93.22 331.24,87.4 | v329.24,87.4 331.24,87.4 | 331.24,87.4 331.24,85.62 330.99,85.37 v329.24,85.37
  other vias: 323.72,48.72 323.85,50.55 323.72,52.25 323.72,54.08 326.64,50.55 326.64,48.77 326.64,52.32 326.64,54.1 327.66,56.13 327.66,57.4 327.66,58.67 327.66,59.94 327.2,85.37 325.17,85.37 323.14,85.37 323.14,87.4 325.17,87.4 327.2,87.4 327.66,64.01 325.88,64.01 324.1,64.01 322.58,64.01 322.58,61.72 324.1,61.72 325.88,61.72 327.66,61.72
  pour Top (no thermals): 321.82,48.26 322.58,47.5 327.46,47.5 328.57,48.62 328.57,64.52 328.07,65.02 320.55,65.02 320.04,64.52 320.04,61.47 321.06,60.45 322.81,60.45 323.85,59.41 323.85,55.63 322.83,54.61 321.82,54.61
  pour Top (no thermals): 320.68,82.73 322.02,82.73 322.38,83.08 322.38,84.1 322.1,84.38 320.68,84.38 320.68,85.95 321.11,86.39 321.04,96.96 321.93,97.85 329.85,97.85 331.03,96.67 331.01,89.69 331.01,80.8 329.74,79.53 321.36,79.53 320.68,80.21
  pour Top (no thermals): 319.02,64.52 328.93,64.52 335.28,70.87 335.28,77.22 335.81,77.75 336.96,77.75 338.07,78.87 338.07,101.6 334.26,105.41 331.22,105.41 330.71,104.9 330.71,103.63 331.22,103.12 332.49,103.12 335.53,100.08 335.53,97.28 335.03,96.77 330.45,96.77 330.45,81.03 329.69,80.26 320.8,80.26 317.5,76.96 317.5,66.04
  pour Route15 (no thermals): 313.94,98.04 312.17,96.27 290.53,96.27 288.59,98.2 283.01,98.2 281.1,96.29 173.94,96.29 172.62,97.61 168.66,97.61 167.31,96.27 147.27,96.27 145.41,98.12 139.55,98.12 137.62,96.19 10.08,95.94 9.4,95.25 9.4,90.68 9.91,90.17 77.72,90.17 78.49,90.93 80.52,90.93 81.28,90.17 81.28,89.92 151.38,89.92 152.15,90.68 154.18,90.68 154.18,90.17 154.43,89.92 166.37,89.92 167.89,88.39 222.25,88.39 224.79,90.93 227.84,90.93 228.6,90.17 281.69,90.17 282.45,89.41 306.58,89.41 309.88,92.71 313.18,92.71 315.21,90.68 315.72,90.68 322.07,84.33 329.95,84.33 329.95,93.73 330.45,94.23 330.45,97.54 329.95,98.04
  pour Route15 (no thermals): 4.32,17.78 47.75,17.78 48.26,18.29 116.08,18.29 120.14,22.35 131.32,22.35 134.87,18.8 165.35,18.8 172.21,11.94 281.69,11.94 284.48,14.73 297.43,14.73 297.69,14.48 300.23,14.48 308.99,23.24 308.99,35.18 321.31,47.5 327.41,47.5 328.17,48.26 328.17,64.26 327.86,64.57 314.91,64.57 311.3,68.17 296.32,68.17 294.13,70.36 4.27,70.36 1.55,67.64 1.55,20.55
+VPWR  (via drill 0.64)
  Top 0.61: C104.2 19.05,108.97 20.83,110.74 25.25,110.74 J103.1 | C105.1 55.88,108.71 58.17,111 61.82,111 J104.1 | C204.2 92.71,108.97 94.49,110.74 98.91,110.74 J203.1 | C205.1 129.54,108.71 131.83,111 135.48,111 J204.1 | C304.2 166.37,108.97 168.15,110.74 172.57,110.74 J303.1 | C305.1 203.2,108.71 205.49,111 209.14,111 J304.1 | C404.2 240.03,108.97 241.81,110.74 246.23,110.74 J403.1 | C405.1 276.86,108.71 279.15,111 282.8,111 J404.1
  other vias: 312.42,111.76 309.88,111.76 307.34,111.76 304.8,111.76 302.26,111.76 299.72,111.76 297.18,111.76 297.18,109.22 297.18,104.14 297.18,101.6 299.72,101.6 299.72,104.14 302.26,104.14 304.8,104.14 307.34,104.14 307.34,101.6 309.88,101.6 309.88,104.14 304.8,106.68 302.26,106.68 302.26,109.22 299.72,109.22 304.8,109.22 307.34,109.22 309.88,109.22 312.42,104.14 312.42,101.6 312.42,106.68 312.42,109.22 312.42,99.06 309.88,99.06 307.34,99.06 299.72,99.06 297.18,99.06
  pour Bottom (isolate 0.254, no thermals): 296.42,49.78 296.42,112.78 297.18,113.54 314.2,113.54 314.96,112.78 314.96,96.77 309.63,91.44 309.63,79.5 315.21,73.91 315.21,52.07 311.91,48.77 297.43,48.77
  pour Route15 (no thermals): 17.78,113.54 17.78,96.52 137.36,96.52 139.29,98.45 145.59,98.45 147.42,96.62 167.13,96.62 168.5,97.99 172.77,97.99 174.12,96.65 280.95,96.65 282.85,98.55 288.85,98.55 290.63,96.77 312.17,96.77 313.44,98.04 313.44,112.52 312.42,113.54
C1  (via drill 0.41)
  Top 0.203: IC4.10 315.9,29.73 315.03,30.59 312.31,30.59 302.64,40.26
  Top 0.305: 302.64,40.26 299.85,40.26
  Top 0.406: IC104.2 IC104.1 170.27,18.63 v170.43,18.8
  Top 0.508: J8.1 299.47,40.64 299.85,40.26
  Route15 0.305: v170.43,18.8 174.09,22.45 290.35,22.45 294.13,26.24 294.13,38.08 296.7,40.64 296.93,40.64
  Route15 0.61: J8.1 296.93,40.64
C2  (via drill 0.41)
  Top 0.203: IC4.11 315.4,29.61 314.96,30.05 311.91,30.05 304.75,37.21
  Top 0.305: 304.75,37.21 299.34,37.21
  Top 0.406: IC104.7 IC104.6 174.99,11.94 177.55,11.94 179.32,13.72 v179.32,17.78
  Top 0.508: J8.2 299.34,37.21
  Route15 0.305: v179.32,17.78 183.44,21.89 290.65,21.89 294.64,25.88 294.64,35.71 297.03,38.1 297.18,38.1
  Route15 0.61: J8.2 297.18,38.1
C3  (via drill 0.41)
  Top 0.203: IC4.12 314.14,28.73 313.12,27.71 301.98,27.71
  Top 0.305: 301.12,33.4 301.12,28.57 301.98,27.71
  Top 0.406: IC204.2 IC204.1 204.81,18.63 v204.98,18.8
  Top 0.508: J8.3 298.96,35.56 301.12,33.4
  Route15 0.305: v204.98,18.8 207.52,21.34 290.85,21.34 295.15,25.63 295.15,33.63 297.08,35.56 297.18,35.56
  Route15 0.61: J8.3 297.18,35.56
C4  (via drill 0.41)
  Top 0.203: IC4.13 313.38,27.21 301.44,27.21
  Top 0.305: 300.43,32.11 300.43,28.22 301.44,27.21
  Top 0.406: IC204.7 IC204.6 209.53,11.94 212.09,11.94 213.87,13.72 v213.87,17.78
  Top 0.508: 300.43,32.11 299.52,33.02 J8.4
  Route15 0.305: v213.87,17.78 213.89,17.78 216.88,20.78 291.06,20.78 295.66,25.37 295.66,31.24 297.18,32.77
  Route15 0.61: J8.4 298.2,32.77 297.18,32.77
C5  (via drill 0.41)
  Top 0.203: IC4.14 300.92,26.74
  Top 0.305: 300.92,26.74 299.72,27.94 299.72,30.1
  Top 0.406: IC304.2 IC304.1 239.35,18.63 v239.52,18.8
  Top 0.508: J8.5 299.34,30.48 299.72,30.1
  Route15 0.305: v239.52,18.8 240.97,20.24 291.25,20.24 296.16,25.16 296.16,29.46 297.18,30.48 297.43,30.48
  Route15 0.61: J8.5 297.43,30.48
C6  (via drill 0.41)
  Top 0.203: IC4.15 300.15,26.24
  Top 0.305: 299.21,27.18 300.15,26.24
  Top 0.406: IC304.7 IC304.6 244.08,11.94 246.63,11.94 248.41,13.72 v248.41,17.78
  Top 0.508: J8.6 299.21,27.18
  Route15 0.305: v248.41,17.78 250.34,19.71 291.53,19.71 296.67,24.85 296.67,27.18 297.43,27.94
  Route15 0.61: J8.6 297.43,27.94
C7  (via drill 0.41)
  Top 0.203: IC4.16 300.23,25.74 300.17,25.68 299.97,25.68
  Top 0.406: IC404.2 IC404.1 273.9,18.63 v274.07,18.8 | 299.47,25.68 299.97,25.68
  Top 0.508: J7.1 298.73,25.68 299.47,25.68
  Route15 0.305: v274.07,18.8 291.67,18.8 297.47,24.6
  Route15 0.61: J7.1 297.65,24.6 297.47,24.6
C8  (via drill 0.41)
  Top 0.203: IC4.17 302.61,25.24
  Top 0.305: 302.61,25.24 300.23,22.86 299.72,22.86
  Top 0.406: IC404.7 IC404.6 278.62,11.94 281.18,11.94 282.96,13.72 v282.96,17.78
  Top 0.508: J7.2 299.72,22.86
  Route15 0.305: v282.96,17.78 291.64,17.78 296.72,22.86 297.43,22.86
  Route15 0.61: J7.2 297.43,22.86
D/!C  (via drill 0.3, 0.74)
  Top 0.203: 301.24,7.87 307.59,7.87 312.17,12.45 324.61,12.45 v324.61,12.19 | v325.73,26.47 325.65,26.39 324.68,26.39 324.03,25.74 IC4.45
  Top 0.305: 102.28,10.49 102.46,10.67 130.77,10.67 138.79,2.65 162.16,2.65 164.34,4.83 287.53,4.83 289.31,3.05 293.8,3.05 298.9,8.15 299.97,8.15
  Top 0.508: 301.24,7.87 300.99,8.13 v300.66,8.13 300,8.13 299.97,8.15
  Top 0.61: DS1.4 101.09,9.3 102.28,10.49
  Bottom 0.203: v324.61,12.19 324.61,21.08 325.73,22.2 v325.73,26.47
DIN  (via drill 0.3, 0.74)
  Top 0.203: 299.14,6.91 308.15,6.91 312.42,11.18 v316.99,11.18 | v316.74,17.6 316.74,19.02 316.4,19.36 IC4.28
  Top 0.305: 90.93,6.35 93.47,3.81 115.61,3.81 121.96,10.16 130.4,10.16 138.43,2.14 294.36,2.14 297.87,5.64
  Top 0.508: 299.14,6.91 298.63,6.4 v298.6,6.4 297.84,5.64 297.87,5.64
  Top 0.61: DS1.8 90.93,6.35
  Bottom 0.203: v316.99,11.18 316.74,11.43 v316.74,17.6
GND  (via drill 0.41, 0.51, 0.64, 0.74)
  Top 0.203: 319.02,39.37 318.9,39.5 318.79,39.61 | 319.15,39.5 319.24,39.58 C15.1 | IC4.8 316.9,31.09 C18.1
  Top 0.279: IC103.4 12.38,84.07 12.34,84.07 12.19,83.92 | 4.57,83.9 4.38,84.09 IC102.4 | IC203.4 86.04,84.07 86,84.07 85.85,83.92 | 78.23,83.9 78.04,84.09 IC202.4 | IC303.4 159.7,84.07 159.66,84.07 159.51,83.92 | 151.89,83.9 151.7,84.09 IC302.4 | IC403.4 233.36,84.07 233.32,84.07 233.17,83.92 | 225.55,83.9 225.36,84.09 IC402.4 | IC3.4 306.83,18.49 306.83,18.8 | IC4.23 312.54,22.24 311.62,21.33 | IC4.46 323.12,26.24 C13.1 323.06,26.74 IC4.47 | IC4.35 319.9,19.25 320.06,19.09 | IC5.4 327.51,17.62
  Top 0.305: 311.62,21.33 C19.1
  Top 0.406: IC101.4 6.3,89.96 6.27,89.98 | Q101.5 v5.59,76.35 | Q102.5 13.69,77.47 v13.69,76.35 | IC105.4 40.69,48.51 | IC104.4 169.97,10.67 | 173.52,15.75 C106.1 | IC201.4 79.98,89.96 | Q201.5 v79.25,76.35 | Q202.5 87.35,77.47 v87.35,76.35 | IC205.4 114.34,48.51 | IC204.4 204.51,10.67 | 208.07,15.75 C206.1 | IC301.4 153.65,89.96 | Q301.5 v152.91,76.35 | Q302.5 161.01,77.47 v161.01,76.35 | IC305.4 188,48.51 | IC304.4 239.06,10.67 | 242.61,15.75 C306.1 | IC401.4 227.31,89.96 | Q401.5 v226.57,76.35 | Q402.5 234.67,77.47 v234.67,76.35 | IC405.4 261.67,48.51 | IC404.4 273.6,10.67 | 277.16,15.75 C406.1 | 319.02,39.37 319.02,37.48 318,36.46 Y1.4 318.12,36.46 319.92,34.66 Y1.2 | 318.9,39.5 319.15,39.5 | 319.15,39.5 320.06,39.5 C15.1 | 319.02,39.37 318.79,39.61 C16.1 | 319.15,39.5 319.02,39.37 | 319.02,39.37 v319.02,40.64 | C18.1 316.99,31.61 316.99,31.88 316.13,32.74 | 316.13,32.74 v316.05,32.74 | C19.1 312.09,20.79 v312.09,20.27 | D1.2 315.98,32.89 316.13,32.74 | v324.81,27.43 326.6,27.43 R10.1
  Top 0.508: 12.19,83.92 v10.92,83.92 | 4.57,83.9 v4.57,83.06 | 6.27,89.98 5.78,89.98 5.59,90.17 v5.61,90.17 | 85.85,83.92 v84.58,83.92 | 78.23,83.9 v78.23,83.06 | 79.98,89.96 79.46,89.96 79.25,90.17 v79.27,90.17 | 159.51,83.92 v158.24,83.92 | 151.89,83.9 v151.89,83.06 | 153.65,89.96 153.12,89.96 152.91,90.17 v152.93,90.17 | 233.17,83.92 v231.9,83.92 | 225.55,83.9 v225.55,83.06 | 227.31,89.96 226.78,89.96 226.57,90.17 v226.59,90.17 | 320.06,19.09 320.82,18.33 C12.1 | J6.1 333.97,19.81 C2.1 R12.2 333.71,17.88 332.86,17.02 329.46,17.02 329.21,16.76 v327.47,16.76 327.48,16.78 327.48,17.65 327.51,17.62
  Top 0.61: C101.1 10.16,93.77 v10.16,95.25 | 6.65,100.33 6.6,100.33 | C104.1 19.01,102.11 v17.53,102.11 | C105.2 58.08,100.24 v58.17,100.33 | C108.1 5.84,86.91 v5.84,88.14 | C109.1 13.97,86.91 v13.97,88.14 | C102.1 C107.1 44.36,52.27 v43.31,52.27 43.28,52.27 | 40.69,48.51 v39.62,48.51 | 169.97,10.67 169.16,10.67 v169.16,10.41 | 173.52,15.75 C103.1 173.52,14.01 v172.97,13.46 | R102.1 43.48,100.58 J102.2 | 6.65,100.33 J101.2 | 6.65,100.33 R101.1 | C201.1 83.82,93.77 v83.82,95.25 | 80.31,100.33 80.26,100.33 | C204.1 92.67,102.11 v91.19,102.11 | C205.2 131.74,100.24 v131.83,100.33 | C208.1 79.5,86.91 v79.5,88.14 | C209.1 87.63,86.91 v87.63,88.14 | C202.1 C207.1 118.02,52.27 v116.97,52.27 116.94,52.27 | 114.34,48.51 v113.28,48.51 | 204.51,10.67 203.71,10.67 v203.71,10.41 | 208.07,15.75 C203.1 208.07,14.01 v207.52,13.46 | R202.1 117.14,100.58 J202.2 | 80.31,100.33 J201.2 | 80.31,100.33 R201.1 | C301.1 157.48,93.77 v157.48,95.25 | C304.1 166.33,102.11 v164.85,102.11 | C305.2 205.4,100.24 v205.49,100.33 | C308.1 153.16,86.91 v153.16,88.14 | C309.1 161.29,86.91 v161.29,88.14 | C302.1 C307.1 191.68,52.27 v190.63,52.27 190.6,52.27 | 188,48.51 v186.94,48.51 | 239.06,10.67 238.25,10.67 v238.25,10.41 | 242.61,15.75 C303.1 242.61,14.01 v242.06,13.46 | R302.1 190.81,100.58 J302.2 | J301.2 153.97,100.33 R301.1 | C401.1 231.14,93.77 v231.14,95.25 | 227.63,100.33 227.58,100.33 | C404.1 239.99,102.11 v238.51,102.11 | C405.2 279.06,100.24 v279.15,100.33 | C408.1 226.82,86.91 v226.82,88.14 | C409.1 234.95,86.91 v234.95,88.14 | C402.1 C407.1 265.34,52.27 v264.29,52.27 264.26,52.27 | 261.67,48.51 v260.6,48.51 | 273.6,10.67 272.8,10.67 v272.8,10.41
  Top 0.61: 277.16,15.75 C403.1 277.16,14.01 v276.61,13.46 | R402.1 264.46,100.58 J402.2 | 227.63,100.33 J401.2 | 227.63,100.33 R401.1 | C20.2 108.67,9.1 DS1.1 | 54.1,11.68 54.38,11.41 54.36,11.39 R14.1 | C1.1 301.5,20.32 302.26,21.08 305.05,21.08 305.31,20.83 305.31,19.85 C17.2 305.56,19.81 305.82,19.56 v306.83,19.56 306.83,18.8 | C13.1 323.55,26.67 324,26.67 324.76,27.43 v324.81,27.43 | C12.1 321.81,18.09 v321.81,17.18 | R11.1 302.26,98.3 300.99,99.57 300.99,101.8 J3.2
  Top 1.016: 54.1,11.68 61.47,11.68 62.99,10.16 DS1.19
  other vias: 54.23,52.04 54.23,50.14 54.23,48.23 56.26,52.04 56.26,50.14 56.26,48.23 58.29,52.04 58.29,50.14 58.29,48.23 60.33,52.04 60.33,50.14 60.33,48.23 62.36,52.04 62.36,50.14 62.36,48.23 17.02,52.22 17.02,50.32 17.02,48.41 19.05,52.22 19.05,50.32 19.05,48.41 21.08,52.22 21.08,50.32 21.08,48.41 23.11,52.22 23.11,50.32 23.11,48.41 25.15,52.22 25.15,50.32 25.15,48.41 127.89,52.04 127.89,50.14 127.89,48.23 129.92,52.04 129.92,50.14 129.92,48.23 131.95,52.04 131.95,50.14 131.95,48.23 133.99,52.04 133.99,50.14 133.99,48.23 136.02,52.04 136.02,50.14 136.02,48.23 90.68,52.22 90.68,50.32 90.68,48.41 92.71,52.22 92.71,50.32 92.71,48.41 94.74,52.22 94.74,50.32 94.74,48.41 96.77,52.22 96.77,50.32 96.77,48.41 98.81,52.22 98.81,50.32 98.81,48.41 201.55,52.04 201.55,50.14 201.55,48.23 203.58,52.04 203.58,50.14 203.58,48.23 205.61,52.04 205.61,50.14 205.61,48.23 207.65,52.04 207.65,50.14 207.65,48.23 209.68,52.04 209.68,50.14 209.68,48.23 164.34,52.22 164.34,50.32 164.34,48.41 166.37,52.22 166.37,50.32 166.37,48.41 168.4,52.22 168.4,50.32 168.4,48.41 170.43,52.22 170.43,50.32 170.43,48.41 172.47,52.22 172.47,50.32 172.47,48.41 275.21,52.04 275.21,50.14 275.21,48.23 277.24,52.04 277.24,50.14 277.24,48.23 279.27,52.04 279.27,50.14 279.27,48.23 281.31,52.04 281.31,50.14 281.31,48.23 283.34,52.04 283.34,50.14 283.34,48.23 238,52.22 238,50.32 238,48.41 240.03,52.22 240.03,50.32 240.03,48.41 242.06,52.22 242.06,50.32 242.06,48.41 244.09,52.22 244.09,50.32 244.09,48.41 246.13,52.22 246.13,50.32 246.13,48.41 319.79,48.06 318.52,48.01 319.79,49.53 319.79,51.05 318.52,51.05 318.52,49.53 318.06,52.81 318.03,54.2 318.01,55.55 318.01,56.95 319.07,88.42 319.07,86.13 319.07,83.85 317.8,80.04 319.07,81.56 316.79,81.56 314.5,81.56 312.52,81.53 315.77,80.04 313.23,80.04
  pour Top (no thermals): 55.12,54.61 54.86,54.86 53.59,54.86 53.34,54.61 53.34,48.11 53.95,47.5 62.43,47.5 63.12,48.18 63.12,54.41 62.66,54.86 61.47,54.86 61.21,54.61
  pour Top (no thermals): 17.91,54.79 17.65,55.04 16.38,55.04 16.13,54.79 16.13,48.29 16.74,47.68 25.22,47.68 25.91,48.36 25.91,54.25 25.12,55.04 24.26,55.04 24,54.79
  pour Bottom: 4.24,52.35 12.73,52.35 12.98,52.35 13.97,53.34 38.9,53.34 38.9,36.83 4.24,36.83
  pour Bottom: 74.98,52.96 54.1,52.96 52.4,51.26 46.23,51.26 44.5,49.53 44.45,49.53 44.45,48.01 43.94,47.5 42.93,47.5 41.15,45.72 41.15,36.6 74.98,36.6
  pour Top (no thermals): 128.78,54.61 128.52,54.86 127.25,54.86 127,54.61 127,48.11 127.61,47.5 136.09,47.5 136.78,48.18 136.78,54.41 136.32,54.86 135.13,54.86 134.87,54.61
  pour Top (no thermals): 91.57,54.79 91.31,55.04 90.04,55.04 89.79,54.79 89.79,48.29 90.4,47.68 98.88,47.68 99.57,48.36 99.57,54.25 98.78,55.04 97.92,55.04 97.66,54.79
  pour Bottom: 77.9,52.35 86.39,52.35 86.64,52.35 87.63,53.34 112.51,53.34 112.51,36.83 77.9,36.83
  pour Bottom: 148.51,52.96 127.76,52.96 126.06,51.26 119.89,51.26 118.16,49.53 118.11,49.53 118.11,48.01 117.6,47.5 116.59,47.5 114.81,45.72 114.81,36.7 148.51,36.7
  pour Top (no thermals): 202.44,54.61 202.18,54.86 200.91,54.86 200.66,54.61 200.66,48.11 201.27,47.5 209.75,47.5 210.44,48.18 210.44,54.41 209.98,54.86 208.79,54.86 208.53,54.61
  pour Top (no thermals): 165.23,54.79 164.97,55.04 163.7,55.04 163.45,54.79 163.45,48.29 164.06,47.68 172.54,47.68 173.23,48.36 173.23,54.25 172.44,55.04 171.58,55.04 171.32,54.79
  pour Bottom: 151.56,52.35 160.05,52.35 160.3,52.35 161.29,53.34 186.22,53.34 186.22,36.83 151.56,36.83
  pour Bottom: 222.17,52.96 201.42,52.96 199.72,51.26 193.55,51.26 191.82,49.53 191.77,49.53 191.77,48.01 191.26,47.5 190.25,47.5 188.72,45.97 188.72,36.78 222.17,36.78
  pour Top (no thermals): 276.1,54.61 275.84,54.86 274.57,54.86 274.32,54.61 274.32,48.11 274.93,47.5 283.41,47.5 284.1,48.18 284.1,54.41 283.64,54.86 282.45,54.86 282.19,54.61
  pour Top (no thermals): 238.89,54.79 238.63,55.04 237.36,55.04 237.11,54.79 237.11,48.29 237.72,47.68 246.2,47.68 246.89,48.36 246.89,54.25 246.1,55.04 245.24,55.04 244.98,54.79
  pour Bottom: 225.07,52.35 233.71,52.35 233.96,52.35 234.95,53.34 259.88,53.34 259.88,36.96 225.07,36.96
  pour Bottom: 295.83,52.96 275.08,52.96 273.38,51.26 267.21,51.26 265.48,49.53 265.48,48.06 264.92,47.5 264.11,47.5 262.13,45.52 262.13,36.96 295.83,36.96
  pour Top (no thermals): 317.25,57.91 317.25,59.18 318.39,59.18 318.39,55.24 318.77,54.86 321.06,54.86 321.31,54.61 321.31,48.26 320.55,47.5 318.26,47.5 317.58,48.18 317.58,57.58
  pour Top (no thermals): 321.61,83.41 320.42,83.41 320.27,83.57 320.27,86.06 320.6,86.39 320.6,90.45 317.55,90.45 317.55,85.37 318.06,84.86 318.06,83.08 317.75,82.78 311.71,82.78 311.71,80.8 312.98,79.53 319.58,79.53 320.24,80.19 320.24,82.85 320.47,83.08 321.61,83.08
  pour Bottom: 311.91,82.8 317.75,82.8 318.01,83.06 318.01,88.39 318.52,88.9 329.95,88.9 329.95,66.29 328.68,65.02 318.52,65.02 317.5,66.04 317.5,74.93 311.91,80.52
  pour Route2 (no thermals): 1.27,97.54 15.24,111.51 325.12,111.51 338.07,98.55 338.07,14.22 328.17,4.32 300.23,4.32 297.18,1.27 138.18,1.27 130.3,9.14 121.92,9.14 115.06,2.29 49.53,2.29 47.24,4.57 47.24,8.38 38.61,8.38 38.61,2.54 37.08,1.02 16,1.02 1.27,15.75
GPIO0  (via drill 0.3)
  Top 0.203: IC4.29 316.9,21.46 316.48,21.88 316.48,23.42 v316.46,23.44
  Bottom 0.203: v316.46,23.44 316.46,29.95
  Bottom 0.305: 316.46,29.95 330.45,43.94 330.45,94.23 321.94,102.74
  Bottom 0.508: J2.1 321.56,103.12 321.94,102.74
GPIO1  (via drill 0.3)
  Top 0.203: 306.32,10.41 311.05,15.14 330.1,15.14 v330.45,15.49 | 335.03,24.89 v330.71,24.89 329.56,23.74 IC4.41
  Top 0.305: 146.56,7.62 146.56,7.54 147.9,6.2 285.52,6.35 289.58,10.41
  Top 0.406: 289.58,10.41 290.86,11.68 293.62,11.68 294.89,10.41 306.32,10.41
  Top 0.508: J6.3 335.03,24.89
  Top 0.61: S2.3 146.56,7.62
  Bottom 0.203: v330.45,15.49 330.1,15.85 330.1,24.28 v330.71,24.89
  Bottom 0.305: v330.71,24.89 330.71,35.56 335.03,39.88 335.03,96.01 335.53,96.52 335.53,107.44 333.25,109.73 326.9,109.73 325.25,108.08
  Bottom 0.508: J2.4 325.25,108.08
N$1
  Top 0.508: C4.1 316.65,54.62 IC1.3 IC1.2
  pour Top (no thermals): 314.96,55.63 313.69,54.36 313.69,48.51 296.93,48.51 296.93,45.21 317.25,45.21 317.25,55.63
N$2
  Top 0.203: R8.2 319.92,32.08 317.86,30.02 317.86,28.76 IC4.6
N$3
  Top 0.203: R8.1 318.48,34.05 Y1.1 317.87,34.7 316.89,35.69 316.89,37.16 317.88,38.15 C16.2
N$4
  Top 0.203: IC4.5 318.4,29.95 321.52,33.07 321.52,35.87 320.94,36.46 Y1.3 320.14,36.49 C15.2
N$5
  Top 0.203: IC4.9 316.4,30.58 315.76,31.22 C18.2
  Top 0.406: C18.2 314.66,31.39 R9.1
N$6  (via drill 0.3)
  Top 0.203: v311.35,41.73 311.43,41.73 312.52,42.82 320.29,42.82 322.5,40.61 322.5,32.85 319.4,29.74 IC4.3
  Bottom 0.203: 305.56,6.18 310.08,10.7 310.08,26.36 311.15,27.43 311.15,41.53 v311.35,41.73
  Bottom 0.305: 305.18,3.94 305.56,4.32 305.56,6.18
  Bottom 0.508: S3.3 305.18,3.94
N$7
  Top 0.279: IC4.22 311.58,22.74
  Top 0.305: 311.58,22.74 C19.2
N$8  (via drill 0.3)
  Top 0.203: R10.2 325.01,25.7 v324.87,25.55 324.55,25.24 IC4.44
  Bottom 0.203: 310.14,2.29 310.96,1.47 321,1.47 323.34,3.81 323.34,20.57 324.87,22.1 v324.87,25.55
  Bottom 0.508: S3.7 309.39,3.05 310.14,2.29
N$9
  Top 0.203: IC4.7 317.4,30.18 318.06,30.84 318.06,32.03 316.84,33.25 316.84,35.11 316.13,35.82
  Top 0.305: 316.13,35.82 315.8,36.15
  Top 0.406: C14.1 312.7,35.8 R4.1 314.37,35.81 315.47,35.81 315.8,36.15 315.82,36.17 315.98,36.32 D1.1
N$10
  Top 0.508: IC1.5 321.31,55.63 321.6,55.91 L1.1 321.6,59.15 321.31,59.44 319.32,59.44 C3.2
N$11
  Top 0.508: IC1.1 316.27,57.01 R2.1 C7.1 R1.1
N$12
  Top 0.508: IC1.6 319.31,57.92 C3.1
N$13  (via drill 0.3)
  Top 0.203: v320.45,24.65 320.35,24.74 IC4.18
  Bottom 0.203: 320.8,4.32 320.8,24.38 320.49,24.69 v320.45,24.65
  Bottom 0.305: 320.42,3.94 320.8,4.32
  Bottom 0.508: S3.15 320.42,3.94
N$14  (via drill 0.3)
  Top 0.203: v319.02,23.88 318.65,24.25 IC4.19
  Bottom 0.203: v319.02,23.88 319.21,23.69 319.23,17.65 319.79,17.09 319.79,12.7 318.36,11.28 318.36,4.78
  Bottom 0.305: 317.58,3.99 318.36,4.78
  Bottom 0.508: S3.13 316.99,3.4 317.58,3.99
N$15
  Top 0.203: R5.2 330.2,13.17 330.2,11.43
  Top 0.406: J1.3 330.2,11.43
N$16
  Top 0.203: 335.24,11.43 R3.2
  Top 0.406: J1.1 335.24,10.05 335.24,11.43
N$17  (via drill 0.3)
  Top 0.203: IC4.20 314.84,23.74 v315.21,23.37
  Bottom 0.203: 313.69,3.81 313.69,3.86 313.21,4.34 313.21,18.52 313.06,18.67 313.06,21.21 v315.21,23.37
  Bottom 0.508: S3.11 313.69,3.81
N$18  (via drill 0.3)
  Top 0.203: v323.6,22.5 323.32,22.5 323.08,22.74 IC4.39
  Bottom 0.203: 312.8,2.16 313.06,1.91 320.68,1.91 322.76,3.99 322.76,21.51 323.6,22.35 v323.6,22.5
  Bottom 0.508: S3.9 312.8,2.16
N$19  (via drill 0.3)
  Top 0.203: v326.14,30.48 320.81,30.48 319.94,29.62 319.94,28.77 IC4.2
  Bottom 0.203: 307.72,2.16 308.86,1.02 321.31,1.02 326.64,6.35 326.64,29.97 v326.14,30.48
  Bottom 0.508: S3.5 307.72,2.16
N$20
  Top 0.61: R13.1 54.1,9.14 | 54.1,9.14 R14.2 | 54.1,9.14 DS1.20
N$21  (via drill 0.3)
  Top 0.203: IC4.4 318.9,29.84 321.97,32.92 321.97,40.23 320.04,42.16 312.95,42.16 311.43,40.64 v310.31,40.64
  Bottom 0.203: 303.05,6.63 309.37,12.95 309.37,26.92 310.39,27.94 310.32,40.63 v310.31,40.64
  Bottom 0.305: 302.36,4.21 303.05,4.9 303.05,6.63
  Bottom 0.508: S3.1 301.75,3.6 302.36,4.21
N$22
  Top 0.203: IC4.38 321.93,22.19 322.75,22.19 323.1,21.84 329.18,21.84 329.67,21.36 329.67,19 329.87,18.79 IC5.7
N$23  (via drill 0.64)
  Top 0.61: C20.1 106.17,6.39 DS1.2 | D2.1 51.28,6.63 51.56,6.35 54.06,6.35 R13.2 55.08,6.39 v56.64,4.83
  Top 1.016: v56.64,4.83 v58.42,4.83
  Bottom 1.016: DS1.2 106.17,6.86 104.14,4.83 v58.42,4.83 v56.64,4.83
N$24  (via drill 0.3)
  Top 0.203: 337.82,21.84 338.33,21.34 338.33,17.53 336.8,16 331.22,16 330.86,16.36 330.05,16.36 329.34,15.65 316.33,15.65 v315.98,16 | v315.98,18.54 315.9,18.62 IC4.27
  Top 0.508: J6.2 337.31,22.35 337.82,21.84
  Bottom 0.203: v315.98,16 v315.98,18.54
N$25  (via drill 0.3)
  Top 0.203: R3.1 332.45,14.55 318.08,14.55 v317.88,14.35 | v317.75,18.23 317.4,18.59 IC4.30
  Bottom 0.203: v317.75,18.23 317.88,18.11 v317.88,14.35
N$26
  Top 0.203: IC4.43 327.76,24.74 332.99,29.97 335.03,29.97
  Top 0.508: J6.5 335.03,29.97
N$27
  Top 0.203: IC4.42 328.79,24.24 331.98,27.43 335.03,27.43
  Top 0.508: J6.4 335.03,27.43
N$28  (via drill 0.3)
  Top 0.279: IC3.7 304.32,17.28 304.8,16.79 v304.83,16.79
  Top 0.406: C14.2 310.09,34.33 v308.36,36.07
  Bottom 0.203: v308.36,36.07 308.58,35.84 308.58,28.93 304.8,25.15 304.8,16.82 v304.83,16.79
N$29  (via drill 0.3)
  Top 0.203: R5.1 318.72,13.21 v318.72,13.28 | v318.8,17.02 318.8,18.39 317.94,19.24 317.94,20.21 IC4.31
  Bottom 0.203: v318.72,13.28 318.8,13.36 v318.8,17.02
N$30  (via drill 0.3)
  Top 0.203: 330.71,18.29 R12.1 329.18,18.29 v328.8,17.91 | 330.71,18.29 IC5.6 | IC5.5 330.5,18.09 330.71,18.29 | v329.16,22.91 328.75,23.31 323.07,23.31 323,23.24 IC4.40
  Bottom 0.203: v328.8,17.91 328.8,17.98 329.16,18.34 v329.16,22.91
N$31  (via drill 0.3, 0.41)
  Top 0.203: IC5.2 IC5.1 v328.13,20.07 v328.12,20.07
  Top 0.305: v334.52,98.37 334.26,98.63 314.2,98.63 313.36,97.79 304.55,97.79 | 304.04,98.3 R11.2 303.74,102.02 J3.1
  Top 0.61: J3.1 303.83,98.5 304.04,98.3 304.55,97.79
  Bottom 0.203: v328.12,20.07 328.19,20.14 328.19,34.7 334.26,40.77
  Bottom 0.305: v334.52,98.37 334.26,98.12 334.26,40.77
N$33
  Top 0.406: Q102.4 14.67,79.02 R106.1
N$34
  Top 0.406: R105.1 6.54,79.02 Q101.4
N$35
  Top 0.406: 4.64,78.93 4.32,79.25 3.81,79.25 2.03,81.03 2.03,88.14 4.06,90.17 R103.1 | 4.64,78.93 Q101.6 4.35,77.22 3.34,77.22 R107.1 | R105.2 4.87,79.16 4.64,78.93
N$36  (via drill 0.41)
  Top 0.279: Q101.1 4.57,74.83 4.57,73.91 v4.06,73.41 | v3.07,84.52 3.12,84.58 4.26,84.58 IC102.3
  Bottom 0.279: v4.06,73.41 4.06,82.04 3.05,83.06 3.05,84.54 v3.07,84.52
N$37  (via drill 0.41)
  Top 0.279: Q101.3 8.61,76.97 8.61,83.57 v8.64,83.59 | IC102.7 8.4,85.09 v8.69,85.37
  Bottom 0.279: v8.64,83.59 8.69,83.64 v8.69,85.37
N$38
  Top 0.406: IC101.2 IC101.1 6.94,91.65 R103.2
N$39
  Top 0.203: 8.38,98.04 8.09,98.34 8.09,98.7 | R101.2 8.09,98.76 8.03,98.7
  Top 0.406: IC101.3 8.08,90.61 8.38,90.91 8.38,98.04 8.38,98.35 8.15,98.58 8.03,98.7
  Top 0.61: J101.1 8.09,101 R101.2 8.09,98.7 | 8.09,98.7 8.09,98.64 8.15,98.58 | 8.09,98.7 8.03,98.7
N$40  (via drill 0.41)
  Top 0.406: R107.2 2.54,73.66 v2.29,73.41
  Bottom 0.406: v2.29,73.41 2.29,45.52 2.29,19.56 4.32,17.53 17.27,17.53 17.53,17.53 56.19,17.53 57.91,15.8 114.25,15.8 120.14,9.91 129.54,9.91 132.54,12.9 149.81,12.9 156.47,6.25 162.41,6.25 R109.3
N$41
  Top 0.406: R104.1 15.65,90.21 17.86,88.01 17.86,83.64 15.24,81.03 13.46,81.03 13,80.56 R106.2 13,78.78 12.7,78.49 12.7,77.57 Q102.6 11.76,77.5 R108.1
N$42  (via drill 0.41)
  Top 0.406: IC105.3 42.23,49.46 v42.42,49.28 | IC104.3 166.04,11.61 R109.2
  Bottom 0.406: v42.42,49.28 42.42,49.15 39.62,46.35 39.62,20.57 41.27,18.92 57.02,18.92 58.93,17.02 148.03,17.02 156.67,8.38 R109.2
N$43
  Top 0.406: IC105.1 40.3,50.76 39.62,51.44 39.62,56.08 36.02,59.69 R114.1
N$44  (via drill 0.64)
  Top 0.406: IC105.2 38.58,50.11 R111.1 37.55,50.33 37.08,50.8 37.08,54.61 34.72,56.98 R116.2
  other vias: 21.92,58.32 20.52,58.34 19.18,58.39 17.7,58.39 18.47,59.54 16.79,59.39 16.79,57.3 25.25,57.51 27,57.56 28.83,57.56 30.63,57.56 32.38,57.63 34.14,57.61 26.11,56.24 27.89,56.24 29.67,56.18 31.47,56.16 33.22,56.16 23.55,58.22 27,54.66 28.65,54.66 30.43,54.66 32.46,54.61 34.24,54.66 36.27,54.66 38.05,54.66 35.03,56.16 36.93,56.26 35.81,57.56
  pour Top (no thermals): 16.76,56.13 24.87,56.13 27.15,53.85 38.73,53.85 38.73,55.91 35.97,58.67 22.61,58.67 22.35,58.93 22.35,59.69 19.81,59.69 19.3,60.2 16.51,60.2 16,59.69 16,56.9
  pour Bottom: 39.88,60.71 16.69,60.71 13.74,63.65 4.22,63.65 4.22,52.83 12.7,52.83 13.72,53.85 39.88,53.85
N$45
  Top 0.406: R114.2 23.51,59.69 Q103.4
N$46  (via drill 0.41)
  Top 0.279: IC103.3 11.68,84.59 v10.92,85.34 | v9.65,82.55 9.4,82.3 9.4,73.64 10.01,73.03 11.07,73.03 12.77,74.72 Q102.1
  Bottom 0.279: v10.92,85.34 10.41,85.34 9.65,84.58 v9.65,82.55
N$47  (via drill 0.64)
  other vias: 6.93,22.72 5.66,25.26 6.93,27.8 5.66,30.34 6.93,32.88 5.66,35.42 5.66,65.9 6.93,68.44 9.47,22.72 8.2,25.26 9.47,27.8 8.2,30.34 9.47,32.88 8.2,35.42 8.2,65.9 9.47,68.44 12.01,22.72 10.74,25.26 12.01,27.8 10.74,30.34 12.01,32.88 10.74,35.42 10.74,65.9 12.01,68.44 14.55,22.72 13.28,25.26 14.55,27.8 13.28,30.34 14.55,32.88 13.28,35.42 13.28,65.9 14.55,68.44 17.09,22.72 15.82,25.26 17.09,27.8 15.82,30.34 17.09,32.88 15.82,35.42 17.09,63.36 15.82,65.9 17.09,68.44 15.82,70.98 17.09,73.52 19.63,22.72 18.36,25.26 19.63,27.8 18.36,30.34 19.63,32.88 18.36,35.42 18.36,65.9 19.63,68.44 18.36,70.98 19.63,73.52 19.63,78.6 19.63,83.68 18.36,91.3 19.63,93.84 18.36,96.38 19.63,98.92 22.17,22.72 20.9,25.26 22.17,27.8 20.9,30.34 22.17,32.88 20.9,35.42 22.17,68.44 20.9,70.98 22.17,73.52 20.9,76.06 22.17,78.6 20.9,81.14 22.17,83.68 20.9,86.22 20.9,91.3 22.17,93.84 20.9,96.38 22.17,98.92 22.17,104 24.71,22.72 23.44,25.26 24.71,27.8 23.44,30.34 24.71,32.88 23.44,35.42 24.71,63.36 24.71,68.44 23.44,70.98 24.71,73.52 23.44,76.06 24.71,78.6 23.44,81.14 24.71,83.68 23.44,86.22 23.44,91.3 24.71,93.84 23.44,96.38 24.71,98.92 23.44,101.46 27.25,22.72 25.98,25.26 27.25,27.8 25.98,30.34 27.25,32.88 25.98,35.42 27.25,63.36 25.98,65.9 27.25,68.44 25.98,70.98 27.25,73.52 25.98,76.06 27.25,78.6 25.98,81.14 27.25,83.68 25.98,86.22 25.98,91.3 27.25,93.84 25.98,96.38 27.25,98.92 25.98,101.46 27.25,104 25.98,106.54 29.79,22.72 28.52,25.26 29.79,27.8 28.52,30.34 29.79,32.88 28.52,35.42 29.79,63.36 28.52,65.9 29.79,68.44 28.52,70.98 29.79,73.52 28.52,76.06 29.79,78.6 28.52,81.14 29.79,83.68 28.52,86.22 28.52,91.3 29.79,93.84 28.52,96.38 29.79,98.92 28.52,101.46 29.79,104 28.52,106.54 32.33,22.72 31.06,25.26 32.33,27.8 31.06,30.34 32.33,32.88 31.06,35.42 32.33,63.36 31.06,65.9 32.33,68.44 31.06,70.98 32.33,73.52 31.06,76.06 32.33,78.6 31.06,81.14 32.33,83.68 31.06,86.22 31.06,91.3 32.33,93.84 31.06,96.38 32.33,98.92 31.06,101.46 32.33,104 31.06,106.54 34.87,22.72 33.6,25.26 34.87,27.8 33.6,30.34 34.87,32.88 33.6,35.42 34.87,63.36 33.6,65.9 34.87,68.44 33.6,70.98 34.87,73.52 33.6,76.06 34.87,78.6 33.6,81.14 34.87,83.68 33.6,86.22 33.6,91.3 34.87,93.84 33.6,96.38 34.87,98.92 33.6,101.46 34.87,104 33.6,106.54 37.41,22.72 36.14,25.26 37.41,27.8 36.14,30.34 37.41,32.88 36.14,35.42 37.41,63.36 36.14,65.9 37.41,68.44 36.14,70.98 37.41,73.52 36.14,76.06 37.41,78.6 36.14,81.14 37.41,83.68 36.14,86.22 36.14,91.3 37.41,93.84 36.14,96.38 37.41,98.92 36.14,101.46 37.41,104 38.68,65.9 38.68,70.98 38.68,76.06 38.68,81.14 38.68,86.22 38.68,91.3 38.68,96.38 38.68,101.46 13.28,70.98 10.74,70.98 8.2,70.98 5.66,70.98
  pour Top (isolate 0.305, no thermals): 16.59,61.18 39.88,61.18 39.88,102.87 34.29,108.46 21.59,108.46 20.83,107.7 20.83,100.58 17.53,97.28 17.27,97.28 17.27,90.17 19.05,88.39 19.05,76.71 13.72,71.37 3.05,71.37 2.29,70.61 2.29,20.75 39.73,20.75 39.73,43.78 36.91,46.6 16.87,46.6 15.04,48.43 15.04,59.91
  pour Bottom (no thermals): 39.9,61.21 39.9,102.82 34.14,108.58 21.56,108.58 20.78,107.8 20.78,100.71 17.3,97.23 17.3,89.99 19.1,88.19 19.1,76.86 13.64,71.4 4.24,71.4 4.24,64.26 13.72,64.26 16.76,61.21
  pour Bottom (no thermals): 4.37,36.3 38.76,36.3 38.76,20.75 4.06,20.75 4.06,35.99